# EAGLE design CC3-512KSRAM-V1R03.28.1991-With-Component-Values (EAGLE 5.10)

## Sheet 1 of 7
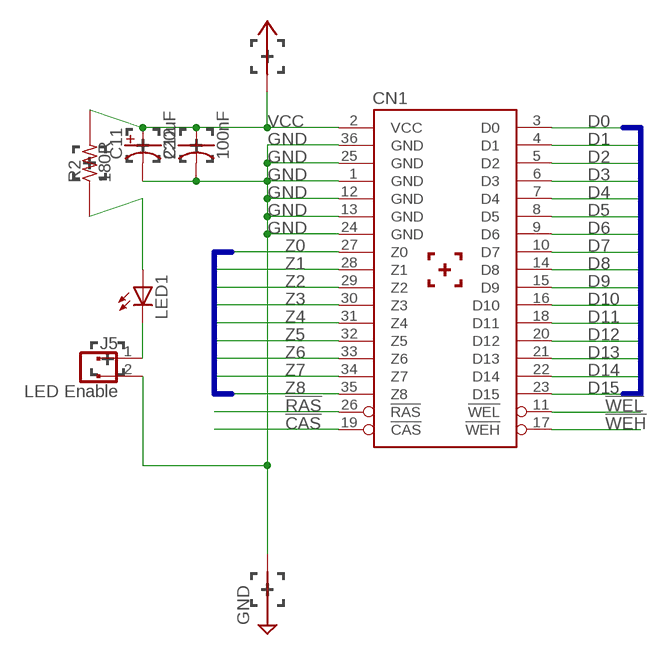
[diagram p0: schematic, sheet 1]

### Parts
C11  220uF  +CAPACITOR--S+[RADIAL]-  [SMALL+RADIAL-]
C12  100nF  CAPACITOR-C050-25X075  [C050-025X075]
CN1  COCO3-MEMORY-EXPANSION-HEADER-STAGGERED  [COCO3-MEMORY-EXPANSION-HEADER-STAGGERED]
J5  LED Enable  M-1X02-SIP-100-32  [SIP-100-02-32]
LED1  LED3MM  [LED3MM]
R2  180R  RESISTOR-R5-PTH  [R5-PTH]

### Nets
!CAS: CN1.19(!CAS) ; also sheet 2
!RAS: CN1.26(!RAS) ; also sheet 2
!WEH: CN1.17(!WEH) ; also sheet 4,5
!WEL: CN1.11(!WEL) ; also sheet 4,5
D0: CN1.3(D0) ; also sheet 4,5
D1: CN1.4(D1) ; also sheet 4,5
D2: CN1.5(D2) ; also sheet 4,5
D3: CN1.6(D3) ; also sheet 4,5
D4: CN1.7(D4) ; also sheet 4,5
D5: CN1.8(D5) ; also sheet 4,5
D6: CN1.9(D6) ; also sheet 4,5
D7: CN1.10(D7) ; also sheet 4,5
D8: CN1.14(D8) ; also sheet 4,5
D9: CN1.15(D9) ; also sheet 4,5
D10: CN1.16(D10) ; also sheet 4,5
D11: CN1.18(D11) ; also sheet 4,5
D12: CN1.20(D12) ; also sheet 4,5
D13: CN1.21(D13) ; also sheet 4,5
D14: CN1.22(D14) ; also sheet 4,5
D15: CN1.23(D15) ; also sheet 4,5
GND [power]: C11.2 C12.2 CN1.1(GND) CN1.12(GND) CN1.13(GND) CN1.24(GND) CN1.25(GND) CN1.36(GND) J5.2 ; also sheet 2,3,4,5,6
N$4: J5.1 LED1.K(C)
N$5: LED1.A R2.1
VCC [power]: C11.1 C12.1 CN1.2(VCC) R2.2 ; also sheet 2,3,6
Z0: CN1.27(Z0) ; also sheet 3,4,5
Z1: CN1.28(Z1) ; also sheet 3,4,5
Z2: CN1.29(Z2) ; also sheet 3,4,5
Z3: CN1.30(Z3) ; also sheet 3,4,5
Z4: CN1.31(Z4) ; also sheet 3,4,5
Z5: CN1.32(Z5) ; also sheet 3,4,5
Z6: CN1.33(Z6) ; also sheet 3,4,5
Z7: CN1.34(Z7) ; also sheet 3,4,5
Z8: CN1.35(Z8) ; also sheet 3,4,5

### Buses
Z[0..8]
D[0..15]

## Sheet 2 of 7
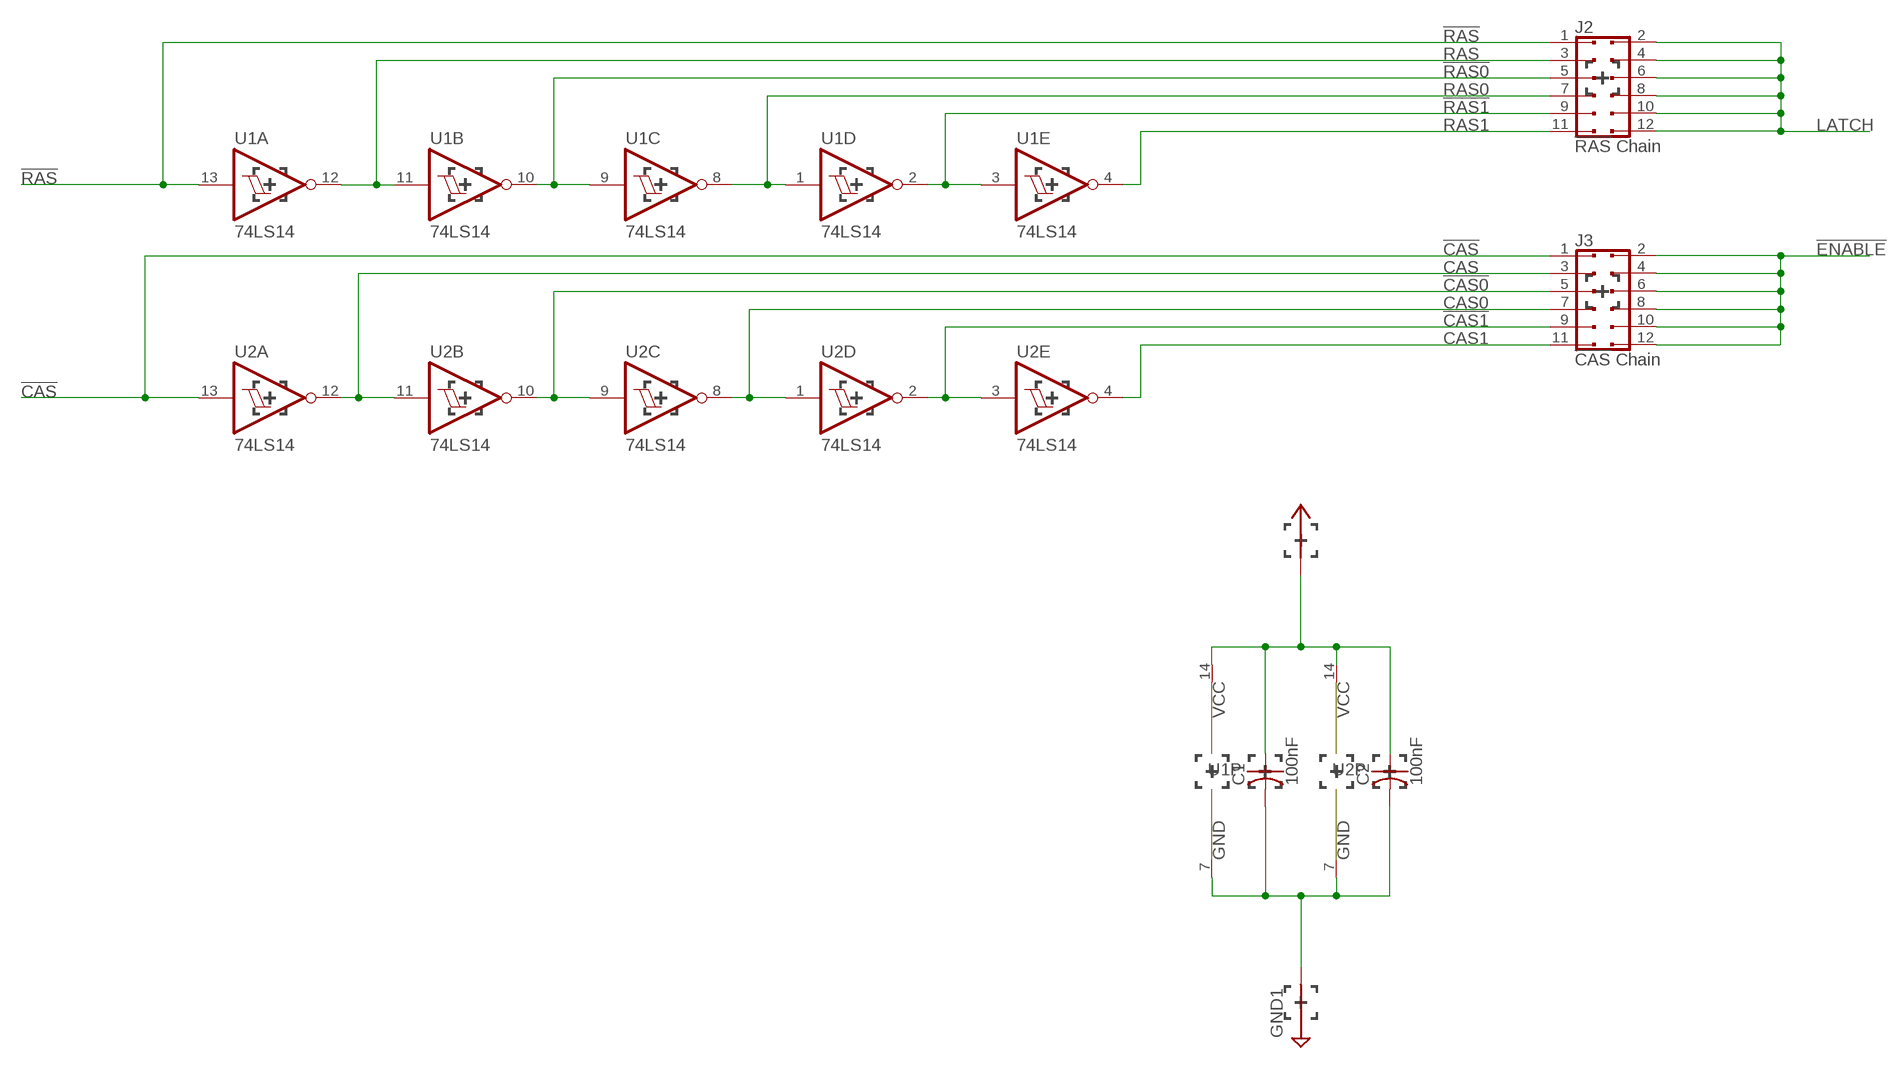
[diagram p1: schematic, sheet 2]

### Parts
C1  100nF  CAPACITOR-C050-25X075  [C050-025X075]
C2  100nF  CAPACITOR-C050-25X075  [C050-025X075]
J2  !RAS! Chain  M-2X06-DIL-100  [DIL-100-2X06]
J3  !CAS! Chain  M-2X06-DIL-100  [DIL-100-2X06]
U1  74LS14  74LS14N  [DIL14-3-TOP]
U2  74LS14  74LS14N  [DIL14-3-TOP]

### Nets
!CAS: J3.1 U2.13(A:I) ; also sheet 1
!CAS0: J3.5 U2.9(C:I) U2.10(B:O)
!CAS1: J3.9 U2.2(D:O) U2.3(E:I)
!ENABLE: J3.2 J3.4 J3.6 J3.8 J3.10 J3.12 ; also sheet 4,5
!RAS: J2.1 U1.13(A:I) ; also sheet 1
!RAS0: J2.5 U1.9(C:I) U1.10(B:O)
!RAS1: J2.9 U1.2(D:O) U1.3(E:I)
CAS: J3.3 U2.11(B:I) U2.12(A:O)
CAS0: J3.7 U2.1(D:I) U2.8(C:O)
CAS1: J3.11 U2.4(E:O)
GND [power]: C1.2 C2.2 U1.7(P:GND) U2.7(P:GND) ; also sheet 1,3,4,5,6
LATCH: J2.2 J2.4 J2.6 J2.8 J2.10 J2.12 ; also sheet 3
RAS: J2.3 U1.11(B:I) U1.12(A:O)
RAS0: J2.7 U1.1(D:I) U1.8(C:O)
RAS1: J2.11 U1.4(E:O)
VCC [power]: C1.1 C2.1 U1.14(P:VCC) U2.14(P:VCC) ; also sheet 1,3,6

## Sheet 3 of 7
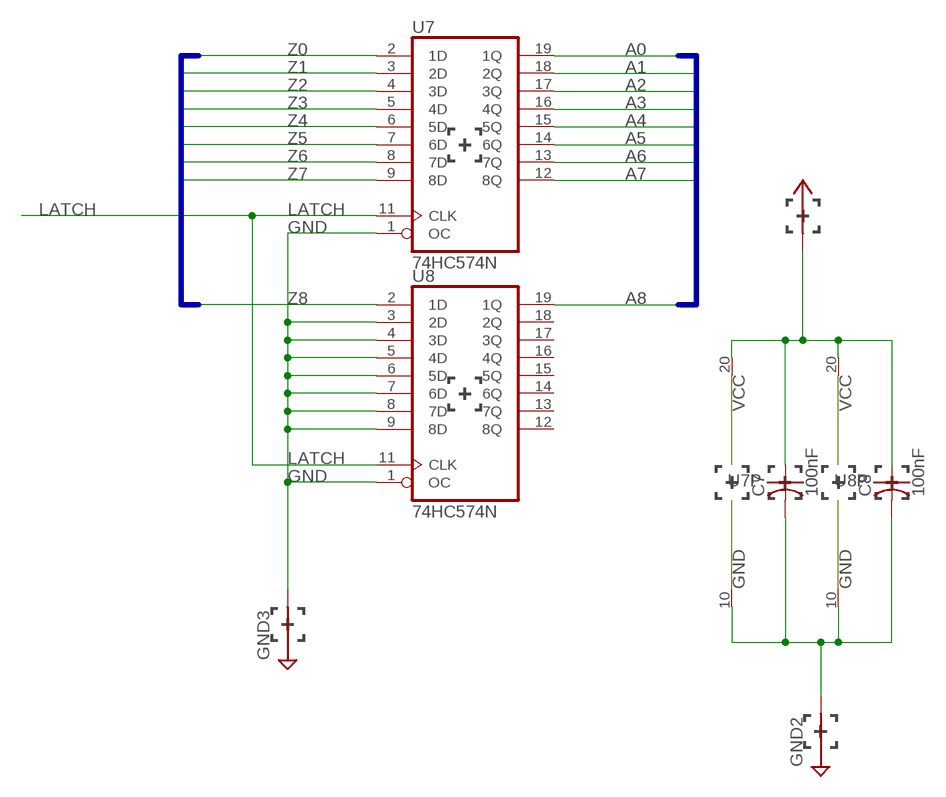
[diagram p2: schematic, sheet 3]

### Parts
C7  100nF  CAPACITOR-C050-25X075  [C050-025X075]
C8  100nF  CAPACITOR-C050-25X075  [C050-025X075]
U7  74HC574N  [DIL20-3-TOP]
U8  74HC574N  [DIL20-3-TOP]

### Nets
A0: U7.19(1Q) ; also sheet 4,5
A1: U7.18(2Q) ; also sheet 4,5
A2: U7.17(3Q) ; also sheet 4,5
A3: U7.16(4Q) ; also sheet 4,5
A4: U7.15(5Q) ; also sheet 4,5
A5: U7.14(6Q) ; also sheet 4,5
A6: U7.13(7Q) ; also sheet 4,5
A7: U7.12(8Q) ; also sheet 4,5
A8: U8.19(1Q) ; also sheet 4,5
GND [power]: C7.2 C8.2 U7.1(OC) U7.10(GND) U8.1(OC) U8.3(2D) U8.4(3D) U8.5(4D) U8.6(5D) U8.7(6D) U8.8(7D) U8.9(8D) U8.10(GND) ; also sheet 1,2,4,5,6
LATCH: U7.11(CLK) U8.11(CLK) ; also sheet 2
VCC [power]: C7.1 C8.1 U7.20(VCC) U8.20(VCC) ; also sheet 1,2,6
Z0: U7.2(1D) ; also sheet 1,4,5
Z1: U7.3(2D) ; also sheet 1,4,5
Z2: U7.4(3D) ; also sheet 1,4,5
Z3: U7.5(4D) ; also sheet 1,4,5
Z4: U7.6(5D) ; also sheet 1,4,5
Z5: U7.7(6D) ; also sheet 1,4,5
Z6: U7.8(7D) ; also sheet 1,4,5
Z7: U7.9(8D) ; also sheet 1,4,5
Z8: U8.2(1D) ; also sheet 1,4,5
Unconnected: U8.12(8Q) U8.13(7Q) U8.14(6Q) U8.15(5Q) U8.16(4Q) U8.17(3Q) U8.18(2Q)

### Buses
Z[0..8]
A[0..8]

## Sheet 4 of 7
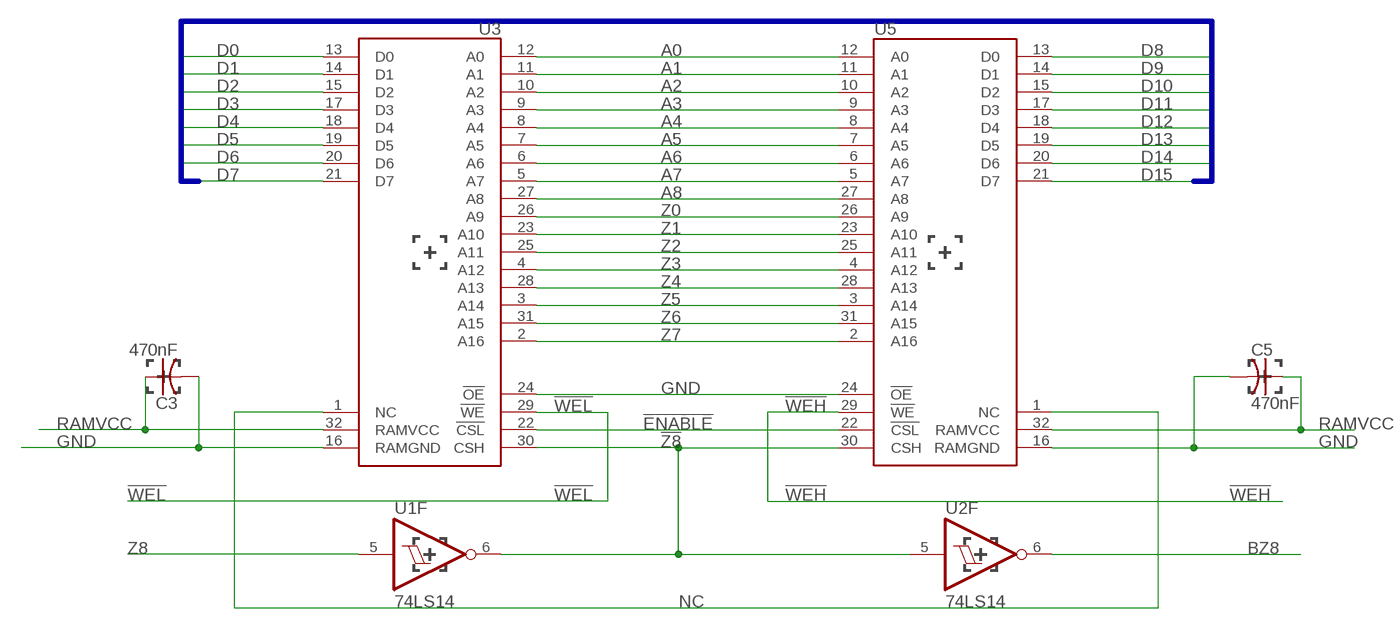
[diagram p3: schematic, sheet 4]

### Parts
C3  470nF  CAPACITOR-C050-25X075  [C050-025X075]
C5  470nF  CAPACITOR-C050-25X075  [C050-025X075]
U3  128KX8-ISOLATED-VCCGNDN-TMO1S  [DIL32-6-TOP-MINIMAL-OUTLINE-1-STAGGERED]
U5  128KX8-ISOLATED-VCCGNDN-BMO1S  [DIL32-6-BOTTOM-MINIMAL-OUTLINE-1-STAGGERED]

### Nets
!ENABLE: U3.22(!CSL) U5.22(!CSL) ; also sheet 2,5
!WEH: U5.29(!WE) ; also sheet 1,5
!WEL: U3.29(!WE) ; also sheet 1,5
!Z8: U1.6(F:O) U2.5(F:I) U3.30(CSH) U5.30(CSH)
A0: U3.12(A0) U5.12(A0) ; also sheet 3,5
A1: U3.11(A1) U5.11(A1) ; also sheet 3,5
A2: U3.10(A2) U5.10(A2) ; also sheet 3,5
A3: U3.9(A3) U5.9(A3) ; also sheet 3,5
A4: U3.8(A4) U5.8(A4) ; also sheet 3,5
A5: U3.7(A5) U5.7(A5) ; also sheet 3,5
A6: U3.6(A6) U5.6(A6) ; also sheet 3,5
A7: U3.5(A7) U5.5(A7) ; also sheet 3,5
A8: U3.27(A8) U5.27(A8) ; also sheet 3,5
BZ8: U2.6(F:O) ; also sheet 5
D0: U3.13(D0) ; also sheet 1,5
D1: U3.14(D1) ; also sheet 1,5
D2: U3.15(D2) ; also sheet 1,5
D3: U3.17(D3) ; also sheet 1,5
D4: U3.18(D4) ; also sheet 1,5
D5: U3.19(D5) ; also sheet 1,5
D6: U3.20(D6) ; also sheet 1,5
D7: U3.21(D7) ; also sheet 1,5
D8: U5.13(D0) ; also sheet 1,5
D9: U5.14(D1) ; also sheet 1,5
D10: U5.15(D2) ; also sheet 1,5
D11: U5.17(D3) ; also sheet 1,5
D12: U5.18(D4) ; also sheet 1,5
D13: U5.19(D5) ; also sheet 1,5
D14: U5.20(D6) ; also sheet 1,5
D15: U5.21(D7) ; also sheet 1,5
GND [power]: C3.2 C5.2 U3.16(RAMGND) U3.24(!OE) U5.16(RAMGND) U5.24(!OE) ; also sheet 1,2,3,5,6
NC: U3.1(NC) U5.1(NC) ; also sheet 5
RAMVCC [power]: C3.1 C5.1 U3.32(RAMVCC) U5.32(RAMVCC) ; also sheet 5,6
Z0: U3.26(A9) U5.26(A9) ; also sheet 1,3,5
Z1: U3.23(A10) U5.23(A10) ; also sheet 1,3,5
Z2: U3.25(A11) U5.25(A11) ; also sheet 1,3,5
Z3: U3.4(A12) U5.4(A12) ; also sheet 1,3,5
Z4: U3.28(A13) U5.28(A13) ; also sheet 1,3,5
Z5: U3.3(A14) U5.3(A14) ; also sheet 1,3,5
Z6: U3.31(A15) U5.31(A15) ; also sheet 1,3,5
Z7: U3.2(A16) U5.2(A16) ; also sheet 1,3,5
Z8: U1.5(F:I) ; also sheet 1,3,5

### Buses
D[0..15]

## Sheet 5 of 7
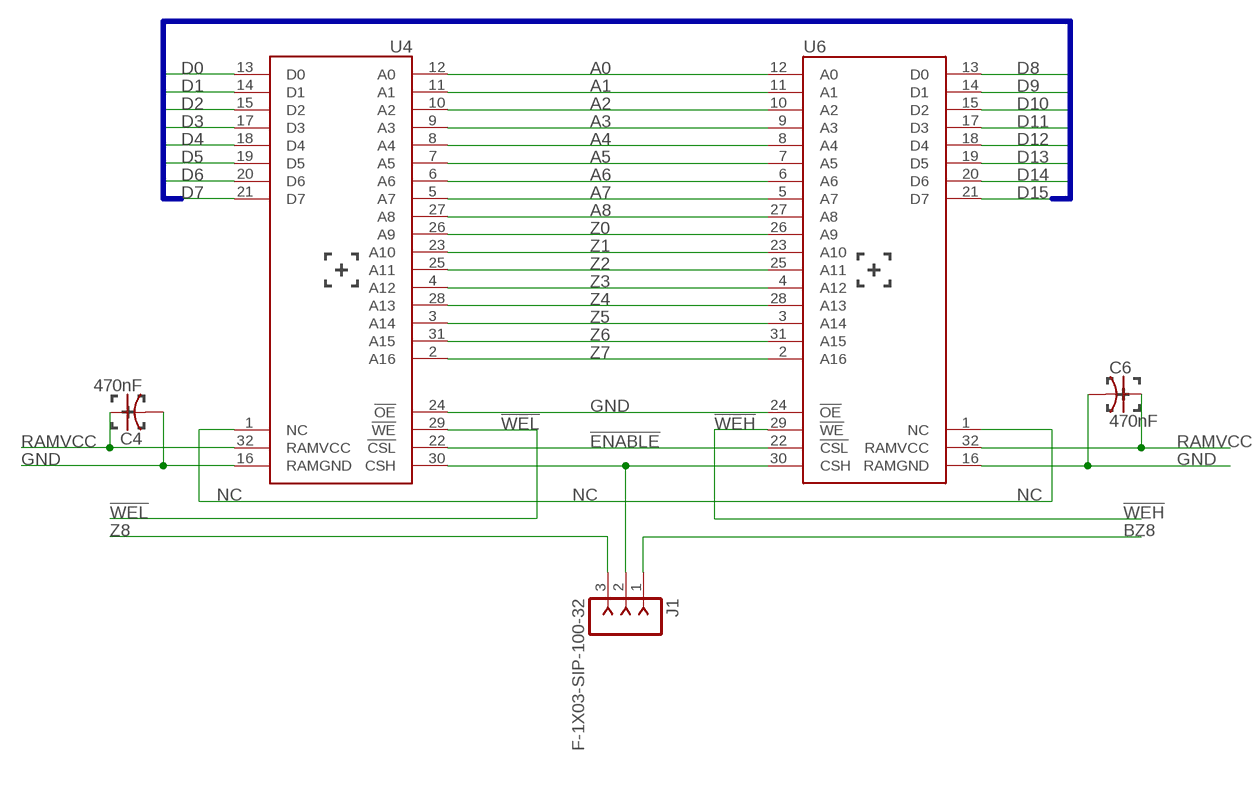
[diagram p4: schematic, sheet 5]

### Parts
C4  470nF  CAPACITOR-C050-25X075  [C050-025X075]
C6  470nF  CAPACITOR-C050-25X075  [C050-025X075]
J1  F-1X03-SIP-100-32  [SIP-100-03-32]
U4  128KX8-ISOLATED-VCCGNDN-TMO1S  [DIL32-6-TOP-MINIMAL-OUTLINE-1-STAGGERED]
U6  128KX8-ISOLATED-VCCGNDN-BMO1S  [DIL32-6-BOTTOM-MINIMAL-OUTLINE-1-STAGGERED]

### Nets
!ENABLE: U4.22(!CSL) U6.22(!CSL) ; also sheet 2,4
!WEH: U6.29(!WE) ; also sheet 1,4
!WEL: U4.29(!WE) ; also sheet 1,4
A0: U4.12(A0) U6.12(A0) ; also sheet 3,4
A1: U4.11(A1) U6.11(A1) ; also sheet 3,4
A2: U4.10(A2) U6.10(A2) ; also sheet 3,4
A3: U4.9(A3) U6.9(A3) ; also sheet 3,4
A4: U4.8(A4) U6.8(A4) ; also sheet 3,4
A5: U4.7(A5) U6.7(A5) ; also sheet 3,4
A6: U4.6(A6) U6.6(A6) ; also sheet 3,4
A7: U4.5(A7) U6.5(A7) ; also sheet 3,4
A8: U4.27(A8) U6.27(A8) ; also sheet 3,4
BZ8: J1.1 ; also sheet 4
D0: U4.13(D0) ; also sheet 1,4
D1: U4.14(D1) ; also sheet 1,4
D2: U4.15(D2) ; also sheet 1,4
D3: U4.17(D3) ; also sheet 1,4
D4: U4.18(D4) ; also sheet 1,4
D5: U4.19(D5) ; also sheet 1,4
D6: U4.20(D6) ; also sheet 1,4
D7: U4.21(D7) ; also sheet 1,4
D8: U6.13(D0) ; also sheet 1,4
D9: U6.14(D1) ; also sheet 1,4
D10: U6.15(D2) ; also sheet 1,4
D11: U6.17(D3) ; also sheet 1,4
D12: U6.18(D4) ; also sheet 1,4
D13: U6.19(D5) ; also sheet 1,4
D14: U6.20(D6) ; also sheet 1,4
D15: U6.21(D7) ; also sheet 1,4
GND [power]: C4.2 C6.2 U4.16(RAMGND) U4.24(!OE) U6.16(RAMGND) U6.24(!OE) ; also sheet 1,2,3,4,6
N$1: J1.2 U4.30(CSH) U6.30(CSH)
NC: U4.1(NC) U6.1(NC) ; also sheet 4
RAMVCC [power]: C4.1 C6.1 U4.32(RAMVCC) U6.32(RAMVCC) ; also sheet 4,6
Z0: U4.26(A9) U6.26(A9) ; also sheet 1,3,4
Z1: U4.23(A10) U6.23(A10) ; also sheet 1,3,4
Z2: U4.25(A11) U6.25(A11) ; also sheet 1,3,4
Z3: U4.4(A12) U6.4(A12) ; also sheet 1,3,4
Z4: U4.28(A13) U6.28(A13) ; also sheet 1,3,4
Z5: U4.3(A14) U6.3(A14) ; also sheet 1,3,4
Z6: U4.31(A15) U6.31(A15) ; also sheet 1,3,4
Z7: U4.2(A16) U6.2(A16) ; also sheet 1,3,4
Z8: J1.3 ; also sheet 1,3,4

### Buses
D[0..15]

## Sheet 6 of 7
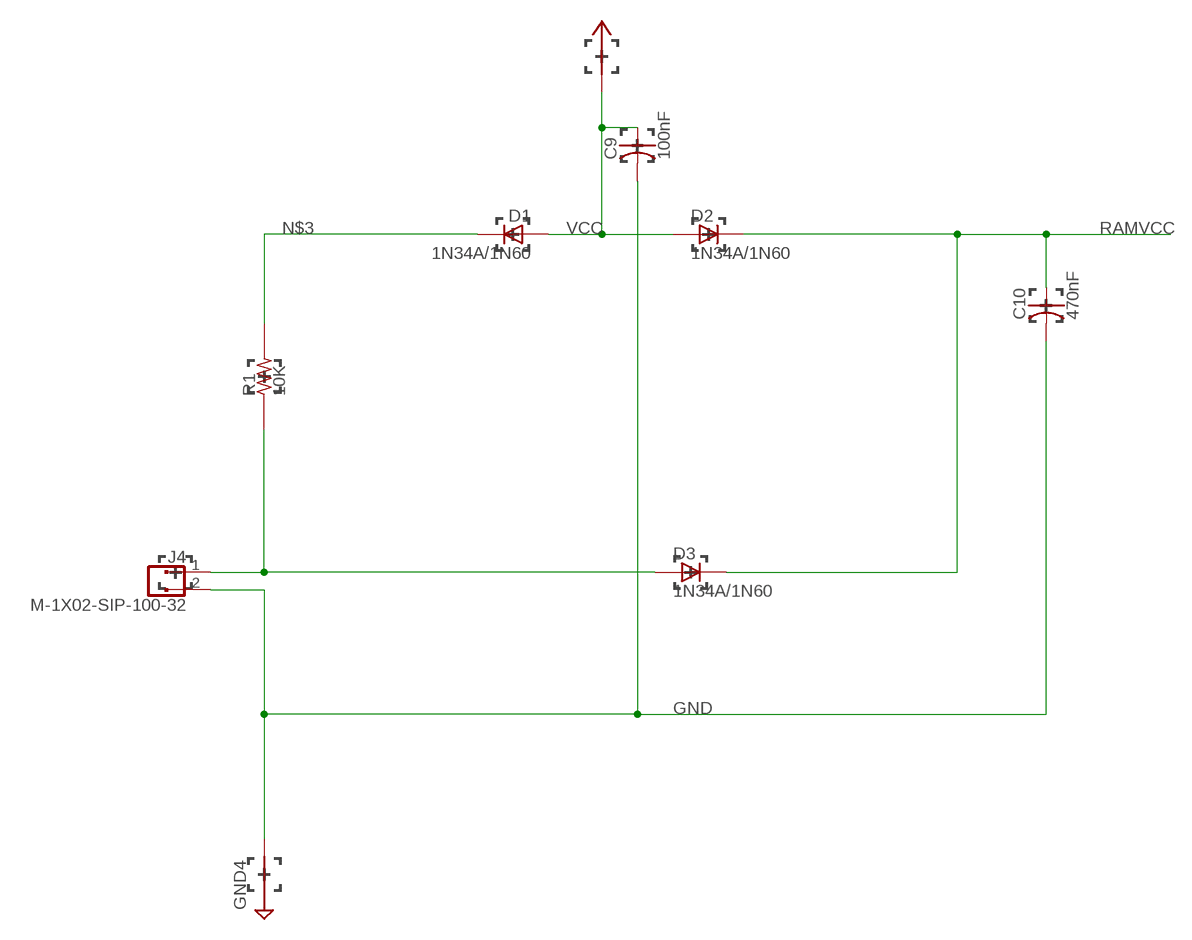
[diagram p5: schematic, sheet 6]

### Parts
C9  100nF  CAPACITOR-C050-25X075  [C050-025X075]
C10  470nF  CAPACITOR-C050-25X075  [C050-025X075]
D1  1N34A/1N60  DIODE  [R5-DIODE-PTH]
D2  1N34A/1N60  DIODE  [R5-DIODE-PTH]
D3  1N34A/1N60  DIODE  [R5-DIODE-PTH]
J4  M-1X02-SIP-100-32  [SIP-100-02-32]
R1  10K  RESISTOR-R5-PTH  [R5-PTH]

### Nets
GND [power]: C9.2 C10.2 J4.2 ; also sheet 1,2,3,4,5
N$2 [power]: D3.A J4.1 R1.1
N$3 [power]: D1.K(C) R1.2
RAMVCC [power]: C10.1 D2.K(C) D3.K(C) ; also sheet 4,5
VCC [power]: C9.1 D1.A D2.A ; also sheet 1,2,3

## Sheet 7 of 7

## Library data of the parts
C1-C10 C12 = TCADT.com-CC3-512KSRAM-V1R03.28.1994:CAPACITOR: Ceramic Chip Capacitor, Non-Polarized Ceramic Chip Capacitor, Non-Polarized References: https://en.wikipedia.org/wiki/Ceramic_capacitor <http://www.tcadt.com/pages/reference/framed_webpages/20170720/20170720ceramic_capacitor.htm> https://www.vishay.com/capacitors/ceramic/surface-mount/ <http://www.tcadt.com/pages/reference/framed_webpages/20170720/20170720vishay_surface_mount_ceramic_capacitor.htm> http://www.mouser.com/Search/ProductDetail.aspx?R=C0805C104M5RACTUvirtualkey64600000virtualkey80-C0805C104M5R <http://www.tcadt.com/pages/reference/framed_webpages/20170720/20170720mouser_c0805c104m5ractu_kemet_surface_mount_ceramic_capacitor.htm> https://www.digikey.com/product-detail/en/kemet/C0805C104K5RACTU/399-1170-1-ND/411445 <http://www.tcadt.com/pages/reference/framed_webpages/20170720/20170720digikey_c0805c104k5ractu_kemet_surface_mount_ceramic_capacitor.htm> http://www.kemet.com/Ceramic%20Capacitors <http://www.tcadt.com/pages/reference/framed_webpages/20170720/20170720kemet_ceramic_capacitors.htm> Copyright ©10 May 2017, by: Tin Cans And Duct Tape, LLC All Rights Reserved. http://www.TCADT.com/ TinCansAndDuctTape@OutLook.com Licensed to: http://www.TinCansAndDuctTape.com TinCansAndDuctTape@gMail.com Tin Cans And Duct Tape, LLC device for Ceramic Chip Capacitor, Non-Polarized. Library format: CADSoft EAGLE v5.xx and earlier. The components, schematic symbols and footprints provided in this library encompass all of the necessary components required for the design, construction and completion of Project: TCADT.com-CC3-2MegDatExtender-Version-1-Revision-06.10.2017 This component library, or libraries, are intended solely for use with Project: TCADT.com-CC3-2MegDatExtender-Version-1-Revision-06.10.2017 and should not be extracted for any other purpose. The TCADT.com library/libraries may, however, be used for personal, non-commercial use. Copyright ©10 May 2017, by: Tin Cans And Duct Tape, LLC All Rights Reserved. http://www.TCADT.com/ TinCansAndDuctTape@OutLook.com Licensed to: http://www.TinCansAndDuctTape.com TinCansAndDuctTape@gMail.com Tin Cans And Duct Tape, LLC component libraries for EAGLE v5.xx. The components, schematic symbols and component footprints contained within this library were created by TCADT.com, under the pen name (pseudonym): Ivan Bliminse. From Wikipedia, the free encyclopedia: <https://en.wikipedia.org/wiki/Pen_name> "A pen name (nom de plume, or literary double) is a pseudonym (or, in some cases, a variant form of a real name) adopted by an author and printed on the title page or by-line of his or her works in place of their "real" name. A pen name may be used to make the author's name more distinctive, to disguise his or her gender, to distance an author from some or all of his or her previous works, to protect the author from retribution for his or her writings, to combine more than one author into a single author, or for any of a number of reasons related to the marketing or aesthetic presentation of the work. The author's name may be known only to the publisher, or may come to be common knowledge." Notice that the accented text indicates the reasoning for the existence of Ivan Bliminse: "to combine more than one author into a single author." This library, in it's entirety, including all related files and parts, has been licensed exclusively to Tin Cans And Duct Tape, LLC. You may use this library of components in your own projects and designs for personal, non-commercial use only. Any other use may require a license. License inquiries may be made to: TCADT.com-CC3-2MegDatExtender-Version-1-Revision-06.10.2017 EAGLE 5.xx Library License Inquiry <mailto:TinCansAndDuctTape@OutLook.com?Subject=TCADT.com-CC3-2MegDatExtender-Version-1-Revision-06.10.2017 EAGLE 5.xx Library License Inquiry>. "One-Off" Licenses are usually granted at no cost. Please take note that we CANNOT guarantee the accuracy of the components, footprints and schematic symbols (nor any part of this library). We make NO guarantees that these libraries, nor any part thereof, are flawless, and we make no promises or guarantees of fitness for production, prototyping or any other purpose. These libraries are provided for informational purposes only, and are used at your own discretion and should not be used to create an actual physical product. By downloading these libraries, you agree that we cannot be held liable nor responsible for faulty PCBs (Printed Circuit Boards) nor any other outcome arising from the use of these libraries, symbols, footprints nor any other component of these libraries and/or downloads. You should always check the component footprint with a 1:1 printout and compare the schematic symbols and footprints with reputable datasheets for same. Neither TCADT.com, TinCansAndDuctTape.com, Ivan Bliminse, Tin Cans And Duct Tape, LLC nor anyone affiliated with same shall be held responsible for any outcome resulting from the usage of these files, libraries, component footprints, schematic symbols nor any other part(s) of these downloads (libraries or otherwise). Should any errors be found, please contact us at one of the above email addresses. We are constantly improving these files, as time allows, thus any feedback is greatly appreciated. In the interest of full disclosure, it is noted that the pseudonym Ivan Bliminse is an anagram of "Invisible Man" in the same way that "Torchwood" is an anagram of "Doctor Who". We thought that you might get a "kick" out of this knowledge, especially if you are a fan of Doctor Who and/or Torchwood. That being said, Ivan Bliminse represents every member of Tin Cans And Duct Tape, LLC and ALL property of any sort, intellectual and/or otherwise, accredited to and/or attributed to Ivan Bliminse is, in fact, the sole property of Tin Cans And Duct Tape, LLC. We have found it especially advantageous to publish under a single entity name, Ivan Bliminse in this case, rather than the somewhat excessively long group name of Tin Cans And Duct Tape, LLC or the multitude of names of the individuals associated with same. We do, however, encourage everyone to credit themselves within their respective works, should they so desire. The use of pseudonyms is, in fact, quite common practice in the world of publishing. As matters of example: Dean Koontz is Aaron Wolfe, Pauline and Jeanne Philips were Abigail Van Buren, Samuel Langhorne Clemens was Mark Twain, Stephen Edwin King is Richard Bachman and John Swithen, etc. Tin Cans And Duct Tape, LLC and all members thereof are Ivan Bliminse. Doctor Who and Torchwood are Copyrights and Trademarks of The BBC. All rights are acknowledged. Non-polarized Ceramic Capacitor
C11 = TCADT.com-CC3-512KSRAM-V1R03.28.1994:+CAPACITOR-
CN1 = TCADT.com-DRAM:COCO3-MEMORY-EXPANSION-HEADER: Tandy Color Computer 3 Memory Expansion Connector Tandy Radio Shack TRS-80 Color Computer 3 Memory Expansion Header. CN6, CN5, CN4 on the CoCo 3 Motherboard. These connectors were intended, by Tandy, to upgrade the CoCo 3 from 128k RAM to 512k RAM. Used by third parties for expansion to: 256k (Burke & Burke Quartermeg), 512k (Tandy and others), 1-Meg (DISTO) 2-Meg (DISTO, Paul Barton and others). Paul Barton also created expansions of up to 64-Meg with a theoretical maximum of 512-Meg. The footprint of this part exactly matches the connector layout on the CoCo 3 motherboard for connectors CN6, CN5 and CN4 (all three connectors are included in this single part). Copyright ©17 May 2011, by: John Eric Turner and his Father. http://www.RetroZilla.org/ RetroZilla.org <mailto:sales@RetroZilla.org> http://www.GIMEchip.com/ sales@GIMEchip.com
D1-D3 = TCADT.com-CC3-512KSRAM-V1R03.28.1994:DIODE
J1 = RetroZilla.org-con-headers-jp:F-1X03-: FEMALE HEADER
J2 J3 = TCADT.com-CC3-512KSRAM-V1R03.28.1994:M-2X06-: MALE HEADER
J4 J5 = TCADT.com-CC3-512KSRAM-V1R03.28.1994:M-1X02-: MALE HEADER
LED1 = adafruit-11-29-2011:LED: LED OSRAM: - CHIPLED LG R971, LG N971, LY N971, LG Q971, LY Q971, LO R971, LY R971 LH N974, LH R974 LS Q976, LO Q976, LY Q976 LO Q996 - Hyper CHIPLED LW Q18S LB Q993, LB Q99A, LB R99A - SideLED LS A670, LO A670, LY A670, LG A670, LP A670 LB A673, LV A673, LT A673, LW A673 LH A674 LY A675 LS A676, LA A676, LO A676, LY A676, LW A676 LS A679, LY A679, LG A679 - Hyper Micro SIDELED® LS Y876, LA Y876, LO Y876, LY Y876 LT Y87S - SmartLED LW L88C, LW L88S LB L89C, LB L89S, LG L890 LS L89K, LO L89K, LY L89K LS L896, LA L896, LO L896, LY L896 - TOPLED LS T670, LO T670, LY T670, LG T670, LP T670 LSG T670, LSP T670, LSY T670, LOP T670, LYG T670 LG T671, LOG T671, LSG T671 LB T673, LV T673, LT T673, LW T673 LH T674 LS T676, LA T676, LO T676, LY T676, LB T676, LH T676, LSB T676, LW T676 LB T67C, LV T67C, LT T67C, LS T67K, LO T67K, LY T67K, LW E67C LS E67B, LA E67B, LO E67B, LY E67B, LB E67C, LV E67C, LT E67C LW T67C LS T679, LY T679, LG T679 LS T770, LO T770, LY T770, LG T770, LP T770 LB T773, LV T773, LT T773, LW T773 LH T774 LS E675, LA E675, LY E675, LS T675 LS T776, LA T776, LO T776, LY T776, LB T776 LHGB T686 LT T68C, LB T68C - Hyper Mini TOPLED® LB M676 - Mini TOPLED Santana® LG M470 LS M47K, LO M47K, LY M47K Source: http://www.osram.convergy.de/
R1 R2 = TCADT.com-CC3-512KSRAM-V1R03.28.1994:RESISTOR
U1 U2 = TCADT.com-CC3-512KSRAM-V1R03.28.1994:74*14: Hex schmitt trigger INVERTER
U3-U6 = TCADT.com-CC3-512KSRAM-V1R03.28.1994:128KX8-ISOLATED-VCCGND
U7 U8 = TCADT.com-CC3-512KSRAM-V1R03.28.1994:74*574: 8-bit D type FLIP FLOP bus driver

## Net classes
0 default: width 0.152 mm, clearance 0.152 mm
1 power: width 0.762 mm, clearance 0.152 mm

## Board
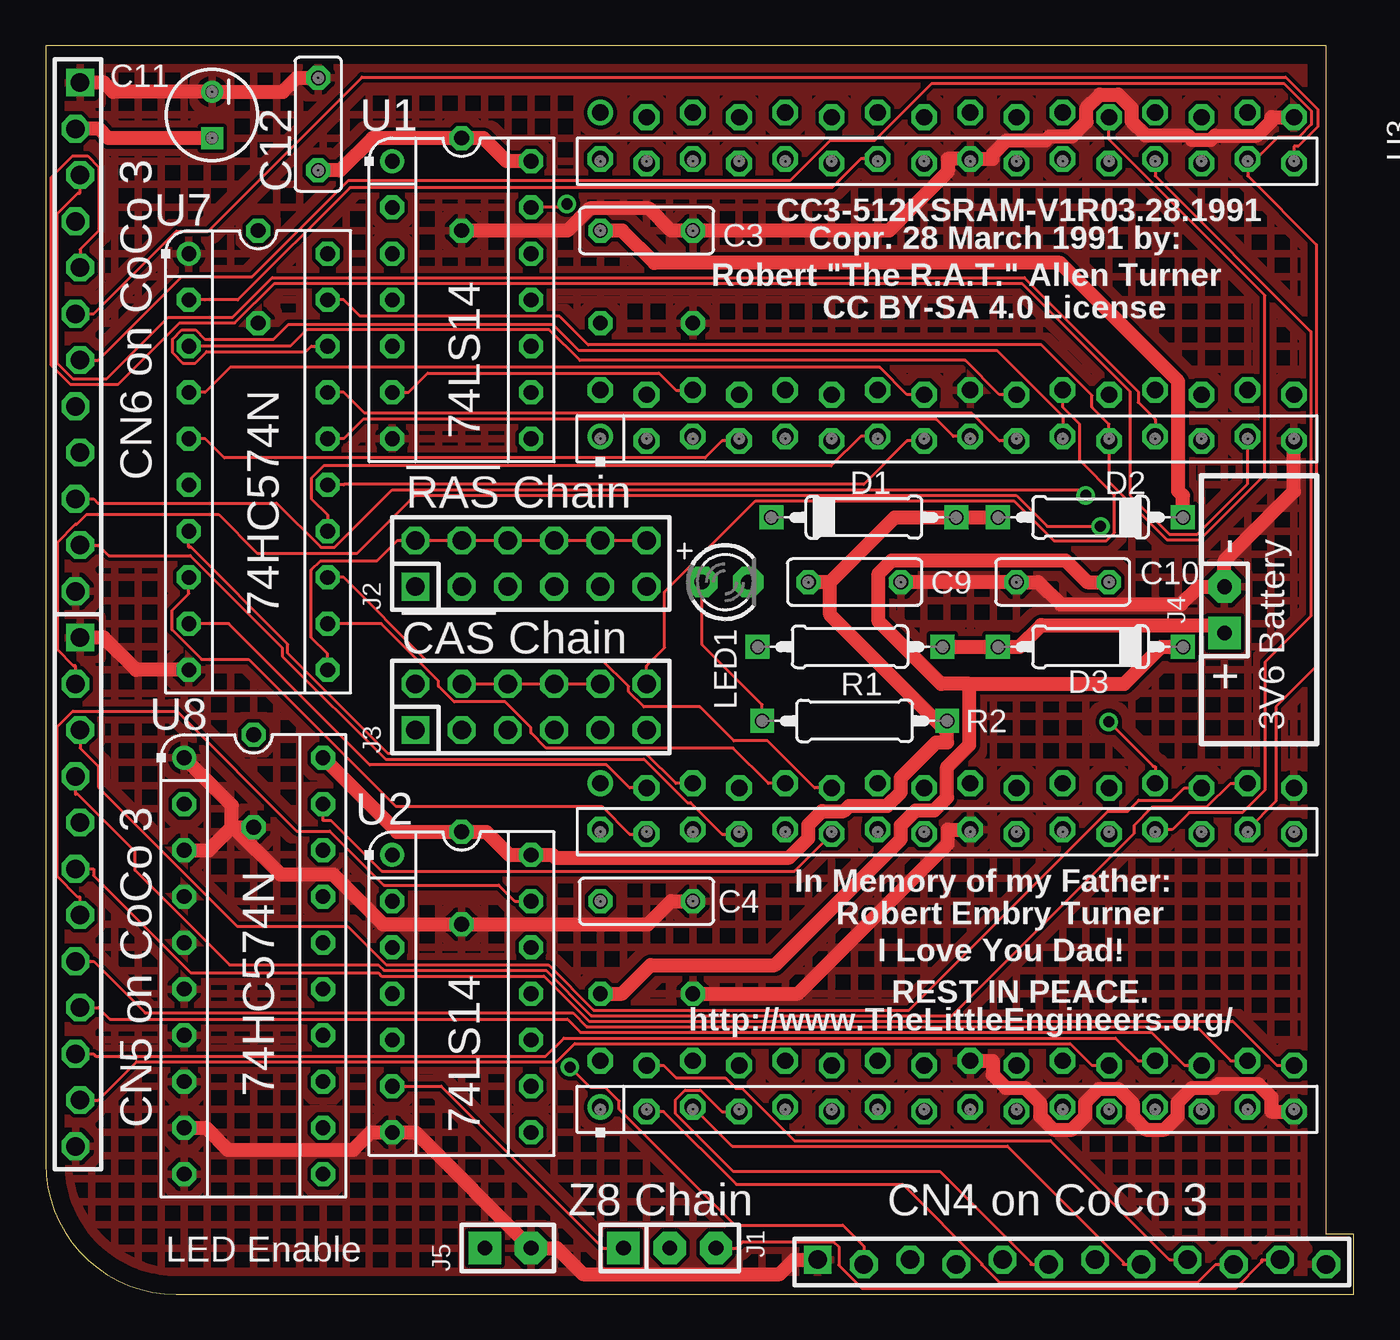
[diagram p6: board, top side]
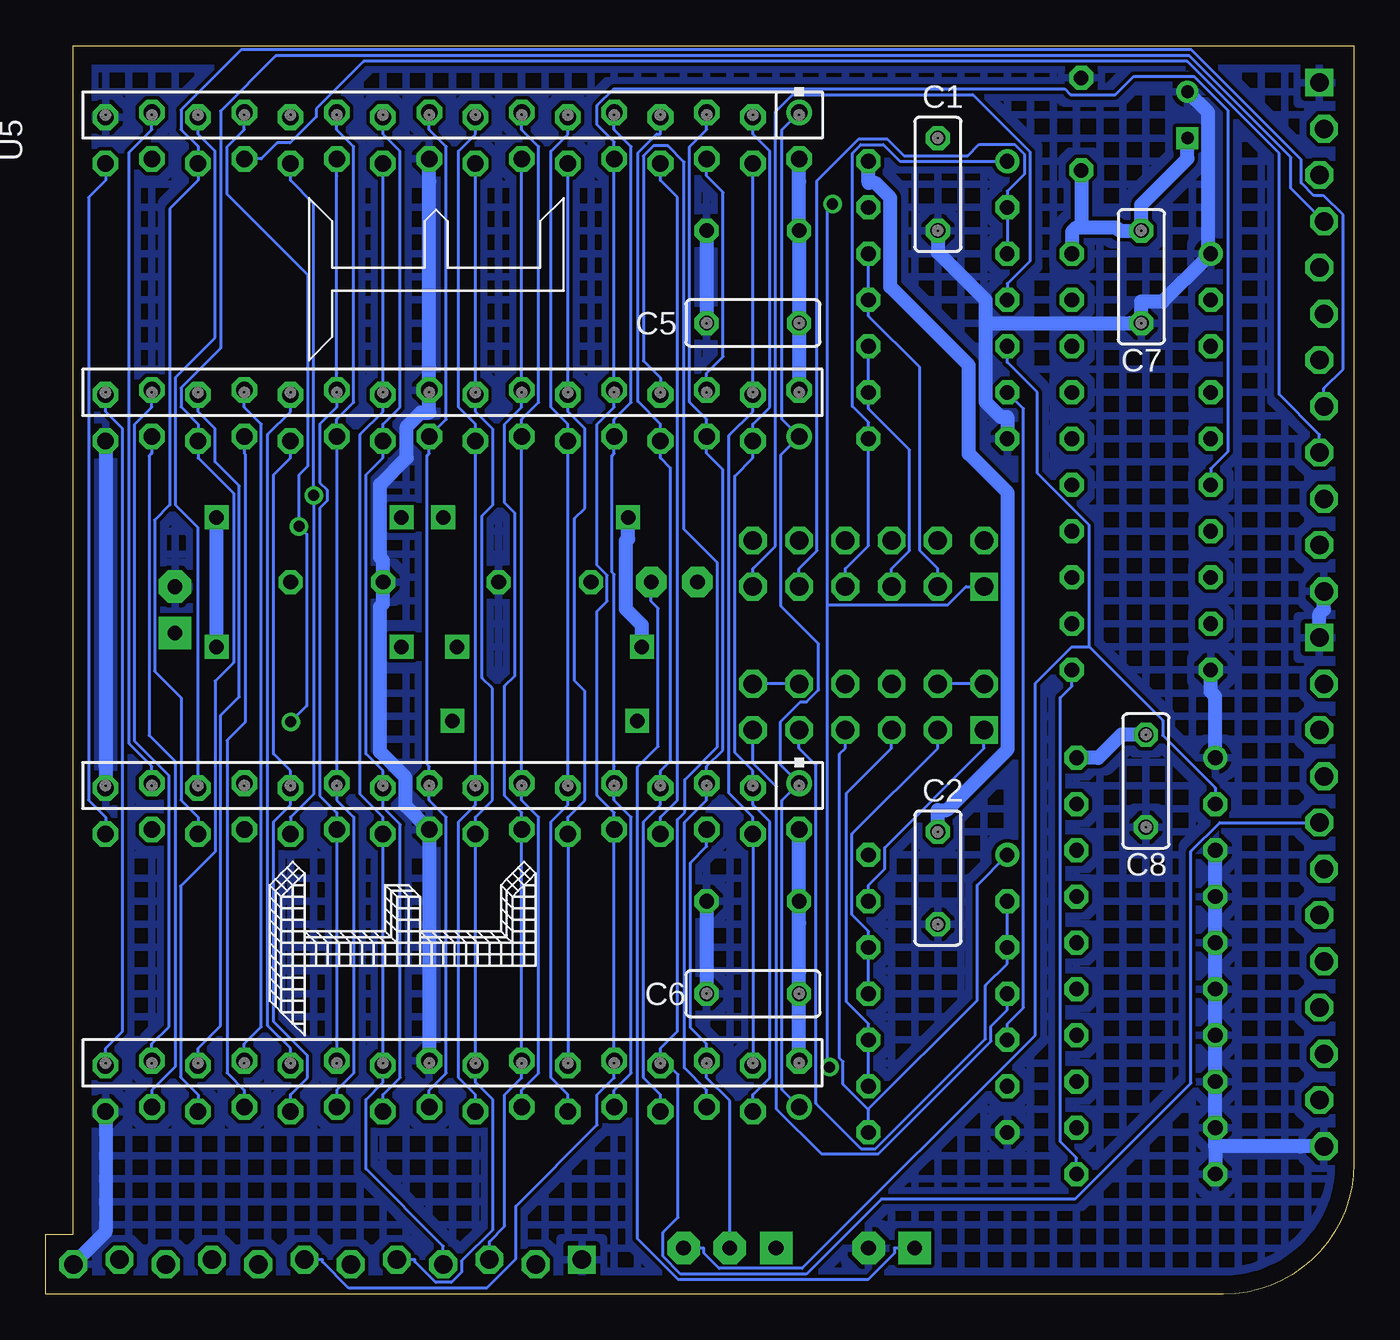
[diagram p7: board, bottom side, seen from below]

Size 71.88 x 68.58 mm. Coordinates in mm from the lower left corner, seen from the top.
Outline: 0,68.58 0,7.18 arc90 7.18,0 71.88,0 71.88,3.3 70.36,3.3 70.36,68.58 0,68.58
Copper layers (1*16): Top 0.035mm / dielectric 1.5mm / Bottom 0.035mm
Design rules "default": minimum track width 10mil, minimum drill 24mil, track to track 8mil, track to pad 8mil, pad to pad 8mil, via to via 8mil, smd to smd 8mil, copper to edge 40mil, drill to drill 8mil, minimum pad ring 10mil, minimum via ring 8mil, stop-mask expansion 4mil, vias tented up to drill 0mil, thermal gap 10mil
vRestrict: area 19.1,41.9 to 34.3,45.7; area 19.1,34.3 to 34.3,38.1

### Footprints (pad centres in the part's own frame; a part is rotated, then mirrored left to right if it is on the bottom)
C050-025X075 = drill 0.813 octagon: 1 -2.54,0; 2 2.54,0
SMALL+RADIAL- = drill 0.7 square: 1 1.27,0 | drill 0.7 round: 2 -1.27,0
COCO3-MEMORY-EXPANSION-HEADER-STAGGERED = drill 1.016 square: 1 0.127,29.21; 13 0.127,-1.27; 25 40.64,-35.433 | drill 1.016 octagon: 2 -0.127,26.67; 3 0.127,24.13; 4 -0.127,21.59; 5 0.127,19.05; 6 -0.127,16.51; 7 0.127,13.97; 8 -0.127,11.43; 9 0.127,8.89; 10 -0.127,6.35; 11 0.127,3.81; 12 -0.127,1.27; 14 -0.127,-3.81; 15 0.127,-6.35; 16 -0.127,-8.89; 17 0.127,-11.43; 18 -0.127,-13.97; 19 0.127,-16.51; 20 -0.127,-19.05; 21 0.127,-21.59; 22 -0.127,-24.13; 23 0.127,-26.67; 24 -0.127,-29.21; 26 43.18,-35.687; 27 45.72,-35.433; 28 48.26,-35.687; 29 50.8,-35.433; 30 53.34,-35.687; 31 55.88,-35.433; 32 58.42,-35.687; 33 60.96,-35.433; 34 63.5,-35.687; 35 66.04,-35.433; 36 68.58,-35.687
R5-DIODE-PTH = drill 0.8 square: A 5.08,0; K -5.08,0
SIP-100-03-32 = drill 0.813 pad 1.778 square: 1 -2.54,0 | drill 0.813 pad 1.778 octagon: 2 0,0; 3 2.54,0
DIL-100-2X06 = drill 1.016 square: 1 -6.35,-1.27 | drill 1.016 octagon: 2 -6.35,1.27; 3 -3.81,-1.27; 4 -3.81,1.27; 5 -1.27,-1.27; 6 -1.27,1.27; 7 1.27,-1.27; 8 1.27,1.27; 9 3.81,-1.27; 10 3.81,1.27; 11 6.35,-1.27; 12 6.35,1.27
SIP-100-02-32 = drill 0.813 pad 1.778 square: 1 -1.27,0 | drill 0.813 pad 1.778 octagon: 2 1.27,0
LED3MM = drill 0.813 pad 1.676 octagon: A -1.27,0; K 1.27,0
R5-PTH = drill 0.8 square: 1 -5.08,0; 2 5.08,0
DIL14-3-TOP = drill 0.813 round: 1 -7.62,-3.81 | drill 0.813 octagon: 2 -5.08,-3.81; 3 -2.54,-3.81; 4 0,-3.81; 5 2.54,-3.81; 6 5.08,-3.81; 7 7.62,-3.81; 8 7.62,3.81; 9 5.08,3.81; 10 2.54,3.81; 11 0,3.81; 12 -2.54,3.81; 13 -5.08,3.81; 14 -7.62,3.81
DIL32-6-TOP-MINIMAL-OUTLINE-1-STAGGERED = drill 0.9 round: 1 -19.05,-7.493 | drill 0.9 octagon: 2 -16.51,-7.747; 3 -13.97,-7.493; 4 -11.43,-7.747; 5 -8.89,-7.493; 6 -6.35,-7.747; 7 -3.81,-7.493; 8 -1.27,-7.747; 9 1.27,-7.493; 10 3.81,-7.747; 11 6.35,-7.493; 12 8.89,-7.747; 13 11.43,-7.493; 14 13.97,-7.747; 15 16.51,-7.493; 16 19.05,-7.747; 17 19.05,7.493; 18 16.51,7.747; 19 13.97,7.493; 20 11.43,7.747; 21 8.89,7.493; 22 6.35,7.747; 23 3.81,7.493; 24 1.27,7.747; 25 -1.27,7.493; 26 -3.81,7.747; 27 -6.35,7.493; 28 -8.89,7.747; 29 -11.43,7.493; 30 -13.97,7.747; 31 -16.51,7.493; 32 -19.05,7.747
DIL32-6-BOTTOM-MINIMAL-OUTLINE-1-STAGGERED = drill 0.9 round: 1 -19.05,7.747 | drill 0.9 octagon: 2 -16.51,7.493; 3 -13.97,7.747; 4 -11.43,7.493; 5 -8.89,7.747; 6 -6.35,7.493; 7 -3.81,7.747; 8 -1.27,7.493; 9 1.27,7.747; 10 3.81,7.493; 11 6.35,7.747; 12 8.89,7.493; 13 11.43,7.747; 14 13.97,7.493; 15 16.51,7.747; 16 19.05,7.493; 17 19.05,-7.747; 18 16.51,-7.493; 19 13.97,-7.747; 20 11.43,-7.493; 21 8.89,-7.747; 22 6.35,-7.493; 23 3.81,-7.747; 24 1.27,-7.493; 25 -1.27,-7.747; 26 -3.81,-7.493; 27 -6.35,-7.747; 28 -8.89,-7.493; 29 -11.43,-7.747; 30 -13.97,-7.493; 31 -16.51,-7.747; 32 -19.05,-7.493
DIL20-3-TOP = drill 0.813 round: 1 -11.43,-3.81 | drill 0.813 octagon: 2 -8.89,-3.81; 3 -6.35,-3.81; 4 -3.81,-3.81; 5 -1.27,-3.81; 6 1.27,-3.81; 7 3.81,-3.81; 8 6.35,-3.81; 9 8.89,-3.81; 10 11.43,-3.81; 11 11.43,3.81; 12 8.89,3.81; 13 6.35,3.81; 14 3.81,3.81; 15 1.27,3.81; 16 -1.27,3.81; 17 -3.81,3.81; 18 -6.35,3.81; 19 -8.89,3.81; 20 -11.43,3.81

### Placement (x,y rotation side)
C1  22.86,60.96 270 bottom
C2  22.86,22.86 270 bottom
C3  33.02,58.42 0 top
C4  33.02,21.59 0 top
C5  33.02,53.34 180 bottom
C6  33.02,16.51 180 bottom
C7  11.68,55.88 270 bottom
C8  11.43,28.19 270 bottom
C9  44.45,39.12 0 top
C10  55.88,39.12 180 top
C11  9.14,64.77 270 top
C12  14.99,64.26 90 top
CN1  1.78,37.34 0 top
D1  44.96,42.67 0 top
D2  57.4,42.67 180 top
D3  57.4,35.56 180 top
J1  34.29,2.54 0 top
J2  26.67,40.13 0 top
J3  26.67,32.26 0 top
J4  64.77,37.59 90 top
J5  25.4,2.54 0 top
LED1  37.34,39.12 0 top
R1  44.2,35.56 180 top
R2  44.45,31.5 0 top
U1  22.86,54.61 270 top
U2  22.86,16.51 270 top
U3  49.53,54.61 0 top
U4  49.53,17.78 0 top
U5  49.53,57.15 0 top
U6  49.53,20.32 0 top
U7  11.68,45.72 270 top
U8  11.43,18.03 270 top
U$1  [TLE-LOGO-10]  44.96,14.22 90 bottom
U$2  [TLE-LOGO-6]  43.43,51.31 90 bottom

### Tracks (layer width: path | path; a pad name or v marks a point on that pad's centre or on a via)
!CAS
  Top 0.152: CN1.19 1.91,21.82 1.78,21.82 0.64,22.96 0.64,31.17 1.5,32.03 7.22,32.03 13.81,25.44 15.62,25.44 18.58,22.48 24.89,22.48 25.78,21.59 U2.13
  Bottom 0.152: J3.1 20.32,30 25.78,24.54 25.78,23.37 26.67,22.48 U2.13
!CAS0
  Bottom 0.152: J3.5 25.4,30 27.88,27.52 27.88,16.06 26.67,14.86 U2.10 U2.9
!CAS1
  Bottom 0.152: U2.2 U2.3 19.05,18.16 20.24,16.97 20.24,14.04 26.28,8 27.08,8 29.55,10.47 29.55,29.06 30.48,30 J3.9
!ENABLE
  Top 0.152: J3.12 33.02,34.52 34.01,35.51 34.01,38.58 39.01,43.57 53.2,43.57 55.4,41.38 58.27,41.38 58.72,41.84 58.72,43.89 56.81,45.79 56.81,47.79 55.88,48.72 U5.22 | J3.4 J3.6 J3.8 J3.10
  Bottom 0.152: U3.22 55.88,61.42 55.88,50.59 U5.22 55.88,48.72 56.81,47.79 56.81,44.58 56.41,44.18 56.41,43.57 56.81,43.17 56.81,27.39 55.88,26.46 U4.22 U6.22 | J3.2 J3.4 | J3.10 J3.12
!RAS  (via drill 0.61 pad 1.02)
  Top 0.152: CN1.26 44.96,2.64 43.8,3.8 37.88,3.8 31.51,10.17 31.51,10.61 30.77,11.35 29.94,11.35 v28.81,12.47 | U1.13 28.46,59.69 v28.65,59.88
  Bottom 0.152: 28.93,37.87 28.93,12.6 v28.81,12.47 | v28.65,59.88 28.93,59.6 28.93,37.87 | 28.93,37.87 22.3,37.87 21.31,38.86 J2.1
!RAS0
  Bottom 0.152: J2.5 25.4,39.85 24.41,40.84 24.41,46.38 26.67,48.64 U1.9 U1.10
!RAS1
  Bottom 0.152: J2.9 30.48,39.85 29.49,40.84 29.49,61.16 27.21,63.45 25.64,63.45 24.73,62.54 21.22,62.54 20.6,63.15 18.64,63.15 18.11,62.62 18.11,61.52 19.05,60.58 U1.2 U1.3
!WEH
  Bottom 0.152: 38.1,13.04 37.13,12.07 37.13,4.23 37.96,3.4 37.96,2.09 36.98,1.11 30.09,1.11 25.97,5.23 15.33,5.23 8.96,11.61 8.96,24.33 7.38,25.91 CN1.17 | 38.1,13.04 38.1,13.51 37.17,14.44 37.17,26.07 36.76,26.48 36.76,28.27 34.97,30.06 34.97,40.18 36.8,42.01 36.8,62.18 37.7,63.08 38.48,63.08 39.03,62.53 39.03,51.27 38.1,50.34 U5.29 | 38.1,13.04 U6.29
!WEL
  Top 0.152: CN1.11 2.9,41.15 3.48,40.56 7.95,40.56 13.01,35.51 13.01,35.05 18.67,29.39 32.88,29.39 35.26,27 35.44,27 37.17,25.27 U4.29
  Bottom 0.152: U3.29 38.1,61.17 37.17,60.24 37.17,27.14 38.1,26.21 U4.29
!Z8
  Top 0.152: U1.6 19.94,49.53 21,50.59 33.69,50.59 34.63,49.66 U5.30
  Bottom 0.152: U2.5 19.05,14.86 18.16,15.75 18.16,48.64 U1.6 | U3.30 35.56,61.42 34.66,60.52 34.66,51.49 35.56,50.59 U5.30
A0
  Top 0.152: U5.12 58.42,63.42 66.98,54.86 66.98,45.02 63.4,41.44 61.6,41.44 58.42,44.62 U3.12 58.42,47.8 57.49,48.73 57.49,49.37 54.71,52.15 29.8,52.15 28.23,53.72 17.27,53.72 16.38,54.61 U7.19
  Bottom 0.152: U3.12 58.42,45.93 59.35,45 59.35,29.68 58.42,28.75 U6.12 58.42,26.88 59.35,25.95 59.35,14.98 57.49,13.12 57.49,11.9 58.42,10.97 U4.12
A1
  Top 0.152: U3.11 55.88,48.22 52.26,51.84 29.29,51.84 27.85,53.27 13.35,53.27 12.53,52.45 8.75,52.45 8.24,52.96 7.48,52.96 6.98,52.45 6.98,51.71 7.55,51.14 8.22,51.14 8.85,51.77 14.3,51.77 14.61,52.07 U7.18
  Bottom 0.152: U4.11 55.88,11.22 54.95,12.15 54.95,26.2 55.88,27.13 U6.11 U3.11 55.88,48.05 54.95,48.98 54.95,63.03 55.88,63.96 U5.11
A2
  Top 0.152: U3.10 52.41,46.86 50.88,48.39 17.53,48.39 16.38,49.53 U7.17
  Bottom 0.152: U5.10 53.34,63.71 52.41,62.78 52.41,48.73 53.34,47.8 U3.10 53.34,46.4 53.34,45.93 54.27,45 54.27,29.68 53.34,28.75 U6.10 53.34,26.75 52.4,25.81 52.4,11.91 53.34,10.97 U4.10
A3
  Top 0.152: U3.9 49.87,47.12 48.94,48.05 17.44,48.05 16.38,46.99 U7.16
  Bottom 0.152: U4.9 50.8,11.22 49.87,12.15 49.87,26.2 50.8,27.13 U6.9 50.8,28.53 50.8,29 50.92,29.12 50.92,46.06 50.8,46.18 50.8,46.65 U3.9 49.87,48.05 49.87,63.03 50.8,63.96 U5.9
A4
  Top 0.152: U7.15 16.38,44.45 16.42,44.49 44.95,44.49 47.33,46.86 U3.8
  Bottom 0.152: U5.8 48.26,63.71 49.19,62.78 49.19,48.73 48.26,47.8 U3.8 U6.8 48.26,26.88 49.19,25.95 49.19,11.9 48.26,10.97 U4.8
A5
  Top 0.152: U7.14 15.49,42.8 14.61,43.69 14.61,44.82 15.28,45.49 43.16,45.49 44.79,47.12 U3.7
  Bottom 0.152: U4.7 45.72,11.22 44.79,12.15 44.79,26.2 45.72,27.13 U6.7 U3.7 45.72,48.05 44.79,48.98 44.79,63.03 45.72,63.96 U5.7
A6
  Top 0.152: U6.6 42.25,27.81 39.66,30.4 37.81,30.4 35.95,32.26 32.87,32.26 32.03,33.1 32.03,33.39 30.58,34.83 20.92,34.83 16.38,39.37 U7.13
  Bottom 0.152: U4.6 43.18,10.97 44.11,11.9 44.11,25.95 43.18,26.88 U6.6 43.18,28.75 43.18,45.93 U3.6 43.18,47.8 44.11,48.73 44.11,62.78 43.18,63.71 U5.6
A7
  Top 0.152: U6.5 39.71,28.07 37.78,30 27.5,30 26.67,30.83 26.67,31.13 25.26,32.54 22.45,32.54 21.59,33.39 21.59,33.68 18.44,36.83 U7.12
  Bottom 0.152: U5.5 40.64,63.96 39.71,63.03 39.71,48.98 40.64,48.05 U3.5 40.64,46.18 40.76,46.06 40.76,39.66 40.64,39.54 40.64,29 U6.5 40.64,27.6 40.64,27.13 39.71,26.2 39.71,12.15 40.64,11.22 U4.5
A8
  Top 0.152: U4.27 41.14,23.24 18.47,23.24 15.67,26.04 15.24,26.04 U8.19
  Bottom 0.152: U6.27 U4.27 43.18,26.21 42.24,27.14 42.24,33.12 42.81,33.68 42.81,42.61 42.25,43.17 42.25,47.54 43.18,48.47 U5.27 U3.27
BZ8
  Top 0.152: J1.1 30.63,2.54 21.74,11.43 U2.6
CAS
  Bottom 0.152: J3.3 22.86,30 27.57,25.29 27.57,20.84 26.67,19.94 U2.12 U2.11
CAS0
  Bottom 0.152: 26.69,10.15 28.07,11.53 28.07,12.78 28.26,12.96 28.26,29.68 27.94,30 J3.7 | 26.69,10.15 20.7,16.14 20.7,22.48 U2.1 | 26.69,10.15 26.67,10.13 26.67,9.33 U2.8
CAS1
  Bottom 0.152: U2.4 19.05,15.62 19.94,14.73 19.94,13.91 26.15,7.7 29.24,7.7 31.72,10.18 31.72,27.88 33.02,29.18 J3.11
D0
  Top 0.152: U3.13 60.96,48.05 60.03,48.98 60.03,49.58 53.78,55.83 12.46,55.83 10.28,53.65 6.73,53.65 3.37,50.29 1.48,50.29 0.64,51.14 0.64,59.33 1.78,60.48 1.91,60.48 CN1.3
  Bottom 0.152: U3.13 60.96,46.18 60.91,46.13 60.91,31.43 61.9,30.43 61.9,12.16 60.96,11.22 U4.13
D1
  Bottom 0.152: CN1.4 3.46,60.74 3.46,62.44 9.04,68.02 59.23,68.02 62.26,64.98 62.26,51.96 64.44,49.79 64.44,48.73 63.5,47.8 U3.14 63.5,45.93 61.55,43.98 61.55,34.69 62.57,33.68 62.57,24.3 64.46,22.41 64.46,11.92 63.5,10.97 U4.14
D2
  Top 0.152: CN1.5 1.91,57.38 2.93,58.4 2.93,61.9 2.31,62.52 1.49,62.52 0.32,61.35 0.32,51.03 1.36,49.99 4,49.99 7.36,53.34 10.4,53.34 12.58,55.52 53.65,55.52 59.58,49.59 59.58,43.89 61.72,41.75 63.28,41.75 66.04,44.51 U3.15
  Bottom 0.152: U3.15 66.04,46.18 66.19,46.03 66.19,30.7 64.77,29.27 64.77,12.49 66.04,11.22 U4.15
D3
  Top 0.152: CN1.6 2.64,53.85 7.18,58.39 8.94,58.39 17.39,66.85 68.13,66.85 69.9,65.07 69.9,64.13 68.81,63.04 68.58,63.04 U3.17
  Bottom 0.152: U3.17 68.58,61.17 69.51,60.24 69.51,27.14 68.58,26.21 U4.17
D4
  Top 0.152: U4.18 67.59,27.08 67.59,32.26 69.82,34.49 69.82,57.64 66.04,61.42 66.04,61.89 | 66.04,61.89 67.69,63.54 68.84,63.54 69.55,64.25 69.55,65 68.03,66.51 48.69,66.51 45.55,63.37 43.13,63.37 40.92,61.17 16.64,61.17 11.35,55.88 7.47,55.88 2.9,51.31 CN1.7 | 66.04,61.89 U3.18
D5
  Bottom 0.152: CN1.8 1.65,49.76 0.6,50.81 0.6,59.28 1.66,60.34 2.2,60.34 2.9,61.04 2.9,62.31 8.93,68.34 61.14,68.34 64.43,65.05 64.43,63.97 63.5,63.04 U3.19 63.5,61.17 65.05,59.62 65.05,43.35 65.89,42.52 65.89,34.23 64.43,32.77 64.43,27.14 63.5,26.21 U4.19
D6
  Top 0.152: U3.20 60.96,61.42 69.52,52.87 69.52,37.25 66.98,34.72 66.98,27.69 65.75,26.46 62.83,26.46 61.89,25.53 U4.20
  Bottom 0.152: CN1.9 1.91,47.22 4.12,49.43 4.12,62.66 9.16,67.71 54.4,67.71 57.01,65.1 57.01,64.67 58.45,63.23 59.16,63.23 60.03,62.36 U3.20
D7  (via drill 0.61 pad 1.02)
  Top 0.152: v57.15,43.88 56.84,44.18 19.05,44.18 15.88,41.02 15.13,41.02 12.69,43.45 2.88,43.45 2.64,43.69 CN1.10
  Bottom 0.152: U3.21 58.42,61.17 57.15,59.9 v57.15,43.88 57.15,27.48 58.42,26.21 U4.21
D8  (via drill 0.61 pad 1.02)
  Top 0.152: v57.95,42.17 55.03,42.17 53.33,43.88 20.29,43.88 17.11,40.7 11.63,40.7 9.5,42.83 2.25,42.83 1.71,42.29 1.64,42.29 0.66,41.31 0.66,35.39 1.53,34.52 1.65,34.52 CN1.14 | U6.13 60.96,29 60.85,29 v58.41,31.44
  Bottom 0.152: v58.41,31.44 57.53,32.32 57.53,41.75 v57.95,42.17 57.95,45 57.45,45.5 57.45,55.98 61.89,60.41 61.89,63.03 60.96,63.96 U5.13
D9
  Top 0.152: CN1.15 1.91,30 2.9,29.01 2.9,27.85 10.53,20.21 16.59,20.21 18.72,18.09 27.63,18.09 30.11,15.61 47.43,15.61 58.37,26.54 59.47,26.54 60.06,27.13 61.89,27.13 62.57,27.81 U6.14
  Bottom 0.152: U6.14 63.5,42.1 64.74,43.34 64.74,50.36 62.57,52.54 62.57,62.78 63.5,63.71 U5.14
D10
  Top 0.152: U6.15 65.11,28.07 63.81,26.77 60.81,26.77 59.82,25.77 59.82,25.33 49.8,15.31 29.98,15.31 27.5,17.79 18.59,17.79 18.29,18.09 10.11,18.09 4.92,23.29 4.92,24.31 1.77,27.46 1.65,27.46 CN1.16
  Bottom 0.152: U5.15 66.04,63.96 67.28,62.73 67.28,30.24 66.04,29 U6.15
D11
  Top 0.152: CN1.18 2.64,23.37 2.64,23 7.99,17.65 18.29,17.65 18.46,17.48 27.38,17.48 29.86,15 65.22,15 67.65,12.57 U6.17
  Bottom 0.152: U5.17 68.58,48.47 67.65,47.54 67.65,14.44 68.58,13.51 U6.17
D12
  Top 0.152: CN1.20 2.64,18.29 5.47,15.46 28.97,15.46 29.73,14.7 63.24,14.7 65.11,12.83 U6.18
  Bottom 0.152: U5.18 66.04,48.72 66.97,47.79 66.97,30.36 65.09,28.48 65.09,14.71 66.04,13.76 U6.18
D13
  Top 0.152: CN1.21 2.9,15.75 3.53,15.11 28.67,15.11 29.39,14.39 60.75,14.39 62.57,12.57 U6.19
  Bottom 0.152: U5.19 63.5,48.47 62.57,47.54 62.57,45.72 61.24,44.39 61.24,32.81 62.26,31.79 62.26,14.74 63.5,13.51 U6.19
D14
  Top 0.152: CN1.22 2.64,13.21 2.77,13.08 27.48,13.08 28.48,14.08 58.78,14.08 60.03,12.83 U6.20
  Bottom 0.152: U5.20 60.96,48.72 60.03,47.79 60.03,14.69 60.96,13.76 U6.20
D15
  Top 0.152: CN1.23 2.9,10.67 5,12.77 28.07,12.77 29.06,13.77 56.29,13.77 57.49,12.57 U6.21
  Bottom 0.152: U5.21 58.42,48.47 59.67,47.22 59.67,14.76 58.42,13.51 U6.21
GND
  Top 0.762: U4.24 49.56,25.53 49.56,24.74 41.33,16.51 C6.2 | U4.16 67.34,10.03 67.34,10.82 66.6,11.56 64.44,11.56 64.22,11.33 62.99,11.33 62.2,10.54 62.2,9.77 61.47,9.05 60.45,9.05 59.72,9.77 59.72,10.5 58.93,11.29 57.86,11.29 57.12,10.54 57.12,9.77 56.39,9.05 55.37,9.05 54.64,9.77 54.64,10.5 53.8,11.33 52.76,11.33 52.04,12.05 52.04,12.83 U6.24 | CN1.1 3.2,66.55 3.71,66.04 C11.2 13.03,66.04 13.79,66.8 C12.2 | 10.31,25.65 12.91,23.06 15.8,23.06 18.54,20.32 C2.2 33.1,20.32 34.37,21.59 C4.2 | 10.24,25.65 10.31,25.65 | 10.31,25.65 C8.2 | C1.2 28.67,58.42 29.89,59.64 33.14,59.64 34.37,58.42 C3.2 36.75,58.42 46.34,58.42 49.56,61.65 49.56,62.36 U3.24 51.39,62.36 52.04,62.36 52.04,62.61 52.8,63.37 54.94,63.37 55.16,63.6 56.39,63.6 57.18,64.39 57.18,65.16 57.91,65.88 58.93,65.88 59.66,65.16 59.66,64.43 60.45,63.65 62.75,63.65 62.99,63.41 64.01,63.41 64.25,63.64 66.56,63.64 67.34,64.43 67.34,64.64 U5.16 | CN1.25 41.12,1.91 40.33,1.11 29.52,1.11 28.09,2.54 J5.2 20.32,8.89 U2.7 17.86,8.89 16.9,7.94 10.02,7.94 8.81,9.14 U8.9 | U3.16 68.58,44.1 64.77,40.28 J4.2 63.35,38.86 62.37,37.88 55.77,37.88 54.53,39.12 C10.2 C9.2 | U8.1 10.24,26.85 10.24,25.65 | U8.3 8.97,24.38 10.24,25.65 | CN1.13 3.2,36.07 4.98,34.29 U7.10
  Bottom 0.762: 7.62,8.13 U8.9 U8.8 U8.7 U8.6 U8.5 U8.4 U8.3 | U7.10 7.87,33.1 7.62,32.84 U8.1 | 8.17,56.86 8.01,57.02 8.01,64.9 C11.2 | 8.17,56.86 U7.1 | 8.17,56.86 10.49,54.53 11.68,54.53 C7.2 12.28,53.34 12.88,53.34 20.24,53.34 | U4.16 68.58,3.43 CN1.36 | U6.24 U4.24 52.1,26.83 52.1,28.39 53.51,29.8 53.51,37.75 53.34,37.92 C10.2 53.34,40.31 53.51,40.48 53.51,44.47 52.04,45.94 52.04,47.65 51.26,48.42 50.8,48.42 U5.24 50.8,50.89 50.8,61.12 U3.24 | CN1.13 1.91,37.36 1.65,37.62 CN1.12 | 7.62,8.13 U8.10 | 7.62,8.13 2.95,8.13 CN1.24 | 20.24,53.34 20.24,54.61 22.86,57.23 C1.2 | 20.24,53.34 20.24,49.01 19.42,48.18 19.05,48.18 U1.7 | U3.16 68.58,29.05 U6.16 | C4.2 C6.2 | C3.2 C5.2
  pour Bottom (hatched): 0,68.58 72.39,68.58 72.39,0 0,0
  pour Top (hatched): 0,69.85 72.39,69.85 72.39,0 0,0
LATCH
  Top 0.152: U7.11 15.49,35.18 14.61,36.07 14.61,39.78 15.11,40.28 18.21,40.28 19.33,41.4 J2.2 J2.4 J2.6 J2.8 J2.10 J2.12
  Bottom 0.152: U7.11 15.49,33.4 16.13,32.76 16.13,8.38 15.24,7.49 U8.11
N$1
  Bottom 0.152: J1.2 34.29,10.62 35.56,11.89 U6.30 35.56,13.76 36.45,14.65 36.45,23.7 35.56,24.59 U4.30
N$2
  Top 0.762: J4.1 64.34,36.75 54.7,36.75 53.51,35.56 D3.A R1.1
N$3
  Bottom 0.762: D1.K 39.88,41.49 39.99,41.37 39.99,37.62 39.12,36.75 R1.2
N$4
  Bottom 0.152: J5.1 25.25,2.54 25.25,2.26 26.7,0.81 37.11,0.81 39.37,3.07 39.37,28.96 38.23,30.1 38.23,37.67 38.61,38.05 LED1.K
N$5
  Top 0.152: R2.1 39.37,32.38 36.07,35.68 LED1.A
NC
  Bottom 0.152: U4.1 31.42,11.22 31.42,27.13 U6.1 31.5,29.09 31.5,31.45 30.42,32.54 30.07,32.54 29.41,33.19 29.41,35.73 31.48,37.79 31.48,46.12 U3.1 31.41,48.05 31.41,63.96 U5.1
RAMVCC
  Top 0.762: 50.75,33.53 50.75,30.17 49.53,28.95 49.53,27.27 48.83,26.57 47.81,26.57 46.99,25.76 46.99,25 40.07,18.08 33.25,18.08 | 33.25,18.08 | 33.25,18.08 31.67,16.51 C6.1 | C3.1 31.67,58.42 33.45,56.65 55.73,56.65 62.23,50.14 62.23,44.11 62.48,43.86 D2.K | D3.K 61.3,35.56 59.26,33.53 50.75,33.53 | 50.75,33.53 49.19,33.53 45.76,36.96 45.76,39.58 46.49,40.31 56.03,40.31 57.23,39.12 C10.1
  Bottom 0.762: D3.K D2.K | U3.32 30.48,61.12 C3.1 C5.1 U5.32 | U6.32 C6.1 30.48,17.7 30.48,20.4 C4.1 U4.32
RAS
  Bottom 0.152: U1.12 U1.11 26.67,53.72 23.85,50.9 23.85,40.84 22.86,39.85 J2.3
RAS0
  Bottom 0.152: U1.1 24.95,62.23 25.86,63.13 27.09,63.13 27.56,62.66 27.56,48.77 26.67,47.88 U1.8 26.67,41.12 27.94,39.85 J2.7
RAS1
  Bottom 0.152: J2.11 33.02,39.85 31.78,41.09 31.78,64.94 30.84,65.88 20.94,65.88 17.8,62.74 17.8,56.75 19.05,55.5 U1.4
VCC
  Top 0.762: U8.20 19.3,25.4 C2.1 23.46,25.4 24.21,25.4 25.48,24.13 26.07,24.13 U2.14 27.86,24.13 28.02,23.98 40.85,23.98 41.91,25.04 41.91,25.77 42.67,26.53 43.85,26.53 44.15,26.83 46.23,26.83 46.99,27.59 46.99,28.36 48.94,30.31 49.53,30.31 49.53,30.9 | CN1.2 2.95,64.01 3.45,63.5 C11.1 | 49.53,30.9 43.1,37.33 43.1,39.12 | 49.53,30.9 R2.2 | C12.1 16.18,61.72 17.96,63.5 C1.1 24.05,63.5 25.32,62.23 U1.14 | 43.1,39.12 C9.1 | 43.1,39.12 46.66,42.67 D1.A D2.A
  Bottom 0.762: U8.20 14.05,29.46 12.78,30.73 C8.1 | C11.1 9.14,62.36 11.68,59.82 C7.1 12.88,58.42 13.06,58.6 14.99,58.6 | 14.99,58.6 15.24,58.6 15.49,58.34 U7.20 | C12.1 14.99,58.6 | C2.1 22.86,26.59 22.36,26.59 19.02,29.93 19.02,44.02 21.16,46.15 21.16,51.01 25.48,55.33 25.48,60.22 26.3,61.04 26.67,61.04 U1.14
Z0
  Top 0.152: U7.2 8.76,54.61 10.56,54.61 16.73,60.78 43.21,60.78 44.79,62.36 U3.26
  Bottom 0.152: CN1.27 47.5,2.9 46.65,3.74 46.65,10.96 45.72,11.89 U6.26 U4.26 45.72,26.46 46.65,27.39 46.65,33.41 46.09,33.97 46.09,42.9 46.67,43.48 46.67,47.77 45.72,48.72 U5.26 U3.26
Z1
  Top 0.152: U7.3 13.45,52.07 14.34,52.97 27.68,52.97 29.36,51.29 50.52,51.29 52.41,49.4 U5.23
  Bottom 0.152: CN1.28 50.04,2.64 54.28,6.88 54.28,10.7 53.34,11.64 U6.23 U4.23 53.34,26.21 54.59,27.45 54.59,47.22 53.34,48.47 U5.23 U3.23
Z2
  Top 0.152: U5.25 47.33,49.4 45.83,50.9 10.13,50.9 8.76,49.53 U7.4
  Bottom 0.152: CN1.29 51.59,1.91 51.59,1.79 50.45,0.65 49.58,0.65 49.02,1.21 49.02,1.84 47.31,3.56 47.31,10.69 48.26,11.64 U6.25 U4.25 48.26,26.21 47.33,27.14 47.33,33.28 47.89,33.84 47.89,42.77 47.31,43.35 47.31,47.52 48.26,48.47 U5.25 48.26,50.34 48.26,61.17 U3.25
Z3
  Top 0.152: U4.4 37.17,10.03 35.98,11.22 35.14,11.22 34.6,10.68 34.6,9.93 37.77,6.76 49.15,6.76 54.13,1.77 54.13,1.65 CN1.30 | U3.4 37.17,46.86 36.23,45.93 9.82,45.93 8.76,46.99 U7.5
  Bottom 0.152: U4.4 38.1,10.97 39.03,11.9 39.03,25.95 38.1,26.88 U6.4 38.1,28.75 37.54,29.3 37.54,45.37 38.1,45.93 U3.4 38.1,47.8 39.34,49.03 39.34,62.69 38.32,63.71 38.1,63.71 U5.4
Z4
  Bottom 0.152: CN1.31 56.67,1.91 56.67,1.78 55.23,0.34 47.66,0.34 46.03,1.96 46.03,4.85 41.57,9.31 41.57,10.96 40.64,11.89 U6.28 U4.28 40.64,26.46 41.57,27.39 41.57,37.52 41.02,38.07 41.02,39.48 41.57,40.04 | U7.6 7.87,45.34 6.93,46.28 6.93,65.03 8.79,66.88 12.1,66.88 13.1,65.88 15.57,65.88 15.88,66.2 40.66,66.2 41.57,65.29 41.57,64.22 40.64,63.29 U3.28 U5.28 40.64,48.72 41.57,47.79 41.57,40.04 | 41.57,40.04
Z5
  Top 0.152: CN1.32 59.21,1.65 59.21,1.77 52.85,8.13 37.71,8.13 U4.3 | U6.3 34.63,28.07 33,29.69 18.83,29.69 13.31,35.21 13.31,35.7 7.99,41.02 7.87,41.02 U7.7
  Bottom 0.152: U4.3 35.56,11.22 36.78,12.44 36.78,25.91 35.56,27.13 U6.3 35.56,29 34.67,29.89 34.67,45.29 35.56,46.18 U3.3 35.56,48.05 36.49,48.98 36.49,63.03 35.56,63.96 U5.3
Z6
  Top 0.152: CN1.33 61.75,1.91 55.21,8.44 41.14,8.44 38.26,11.31 37.92,11.31 37.35,11.88 34.64,11.88 33.95,12.57 U6.31 | U4.31 32.09,25.27 30.56,26.8 19.24,26.8 11.16,34.87 8.57,34.87 6.96,36.49 6.96,37.56 7.87,38.48 U7.8
  Bottom 0.152: U6.31 U4.31 33.02,26.21 34.32,27.51 34.32,47.17 33.02,48.47 U5.31 U3.31
Z7
  Top 0.152: CN1.34 64.29,1.65 63.3,0.66 52.39,0.66 51.44,1.62 51.44,1.69 47.09,6.04 37.95,6.04 33.95,10.03 U4.2 | U6.2 32.09,27.81 30.82,29.08 17.81,29.08 10.07,36.83 U7.9
  Bottom 0.152: U4.2 33.02,10.97 32.09,11.9 32.09,25.95 33.02,26.88 U6.2 33.02,28.75 34.02,29.74 34.02,44.93 33.02,45.93 U3.2 33.02,47.33 33.02,47.8 32.09,48.73 32.09,62.78 33.02,63.71 U5.2
Z8
  Top 0.152: CN1.35 66.83,1.91 66.83,1.78 65.39,0.34 44.84,0.34 43.58,1.6 43.58,2.61 43.3,2.9 38.3,2.9 37.95,2.54 J1.3
  Bottom 0.152: 14.55,35.56 15.51,35.56 17.51,33.56 17.51,14.22 30.32,1.42 34.87,1.42 35.71,2.26 35.71,2.54 J1.3 | 14.55,35.56 10.5,31.51 10.5,30.7 7.62,27.81 U8.2 | 14.55,35.56 14.55,42.25 17.4,45.1 17.4,49.53 19.05,51.18 U1.5

### Text on the board
tPlace: CC3-512KSRAM-V1R03.28.1991 | Copr. 28 March 1991 by: | Robert "The R.A.T." Allen Turner | CC BY-SA 4.0 License | !RAS! Chain | - | !CAS! Chain | + | 3V6 Battery | In Memory of my Father: | Robert Embry Turner | I Love You Dad! | REST IN PEACE. | http://www.TheLittleEngineers.org/ | Z8 Chain | LED Enable